# EAGLE design high-power-led-holder (EAGLE 7.5.0)
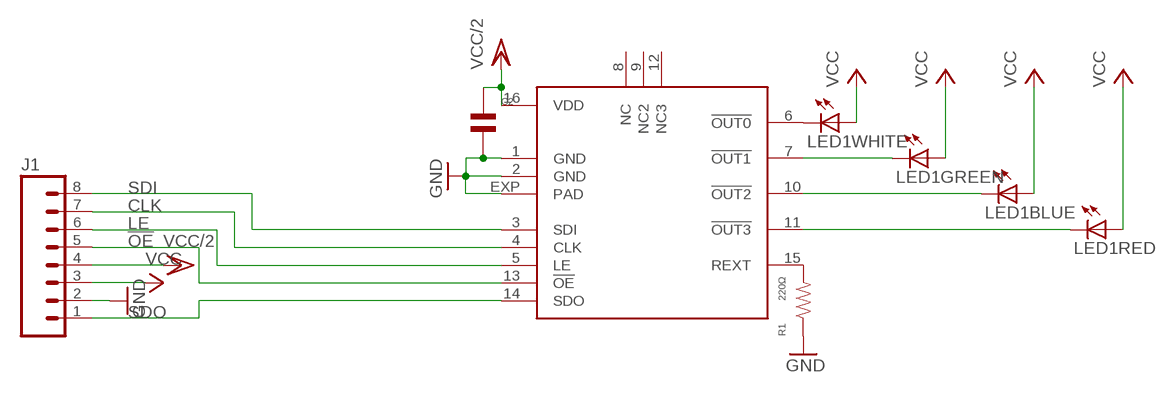
[diagram p0: schematic, sheet 1]

## Parts
C2  CAPACITOR_NP_0805  [C0805]
IC1  STP04CM05  [TSSOP16L]
J1  M08  [1X08_ROUND]
LED1  4WLEDBOARD  [4WLEDBOARD]
R1  220Ω  RESISTOR_0805  [R0805]

## Nets
!OE: IC1.13(!OE) J1.5
CLK: IC1.4(CLK) J1.7
GND: C2.P$2 IC1.1(GND) IC1.2(GND) IC1.EXP(PAD) J1.2 R1.P$1
LE: IC1.5(LE) J1.6
N$2: IC1.7(!OUT1) LED1.G-(GREEN:C)
N$3: IC1.6(!OUT0) LED1.W-(WHITE:C)
N$4: IC1.10(!OUT2) LED1.B-(BLUE:C)
N$5: IC1.11(!OUT3) LED1.R-(RED:C)
N$9: IC1.15(REXT) R1.P$2
SDI: IC1.3(SDI) J1.8
SDO: IC1.14(SDO) J1.1
VCC: J1.3 LED1.B+(BLUE:A) LED1.G+(GREEN:A) LED1.R+(RED:A) LED1.W+(WHITE:A)
VCC/2: C2.P$1 IC1.16(VDD) J1.4
Unconnected: IC1.8(NC) IC1.9(NC2) IC1.12(NC3)

## Library data of the parts
C2 = MF_Passives:CAPACITOR_NP: Library: MF_Passives Description: Device for Non-Polarized Capacitors. Manufacture part number (MFG#), Voltage, Temperature Coefficient, and Tolerance can be added via Attributes.; MFG#: N/A; TEMP_COF: N/A; TOLERANCE: N/A; VOLTAGE: N/A
IC1 = sonik:STP04CM05
J1 = SparkFun-Connectors:M08: Header 8 Standard 8-pin 0.1" header. Use with straight break away headers (SKU : PRT-00116), right angle break away headers (PRT-00553), swiss pins (PRT-00743), machine pins (PRT-00117), and female headers (PRT-00115).; PROD_ID: CONN-08437
LED1 = sonik:4WLEDBOARD
R1 = MF_Passives:RESISTOR: Library: MF_Passives Description: Device for Resistors. Manufacture part number (MFG#), Voltage, Tolerance, and Wattage Rating can be added via Attributes.; MFG#: N/A; TOLERANCE: N/A; VOLTAGE: N/A; WATTAGE: N/A

## Board
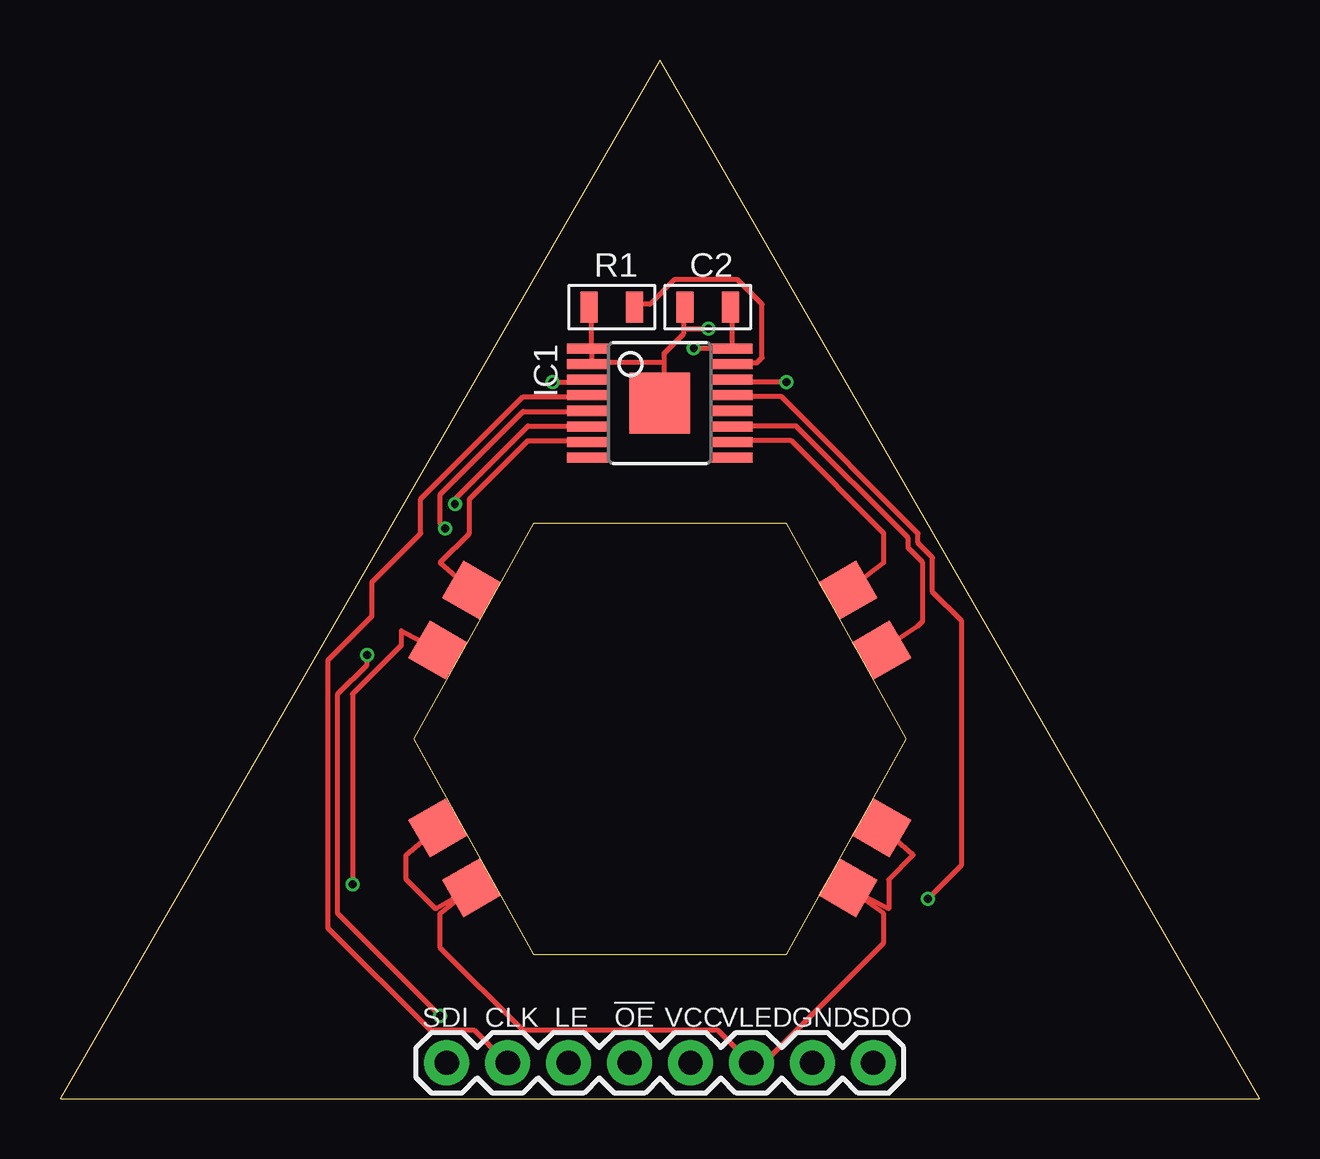
[diagram p1: board, top side]
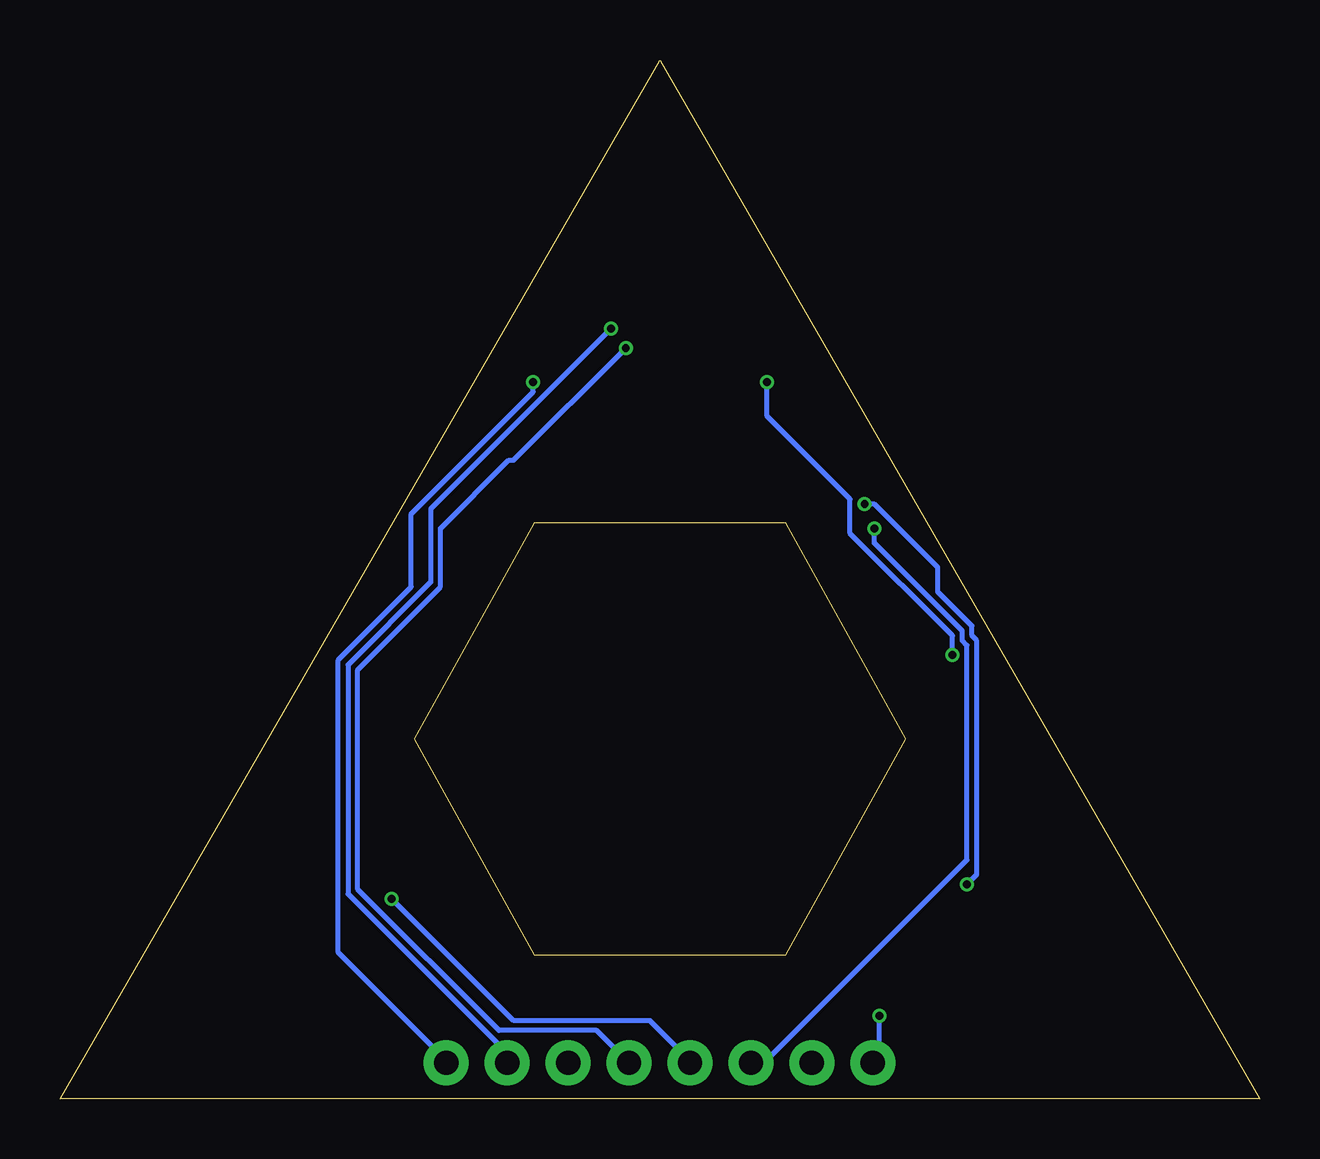
[diagram p2: board, bottom side, seen from below]

Size 50 x 43.3 mm. Coordinates in mm from the lower left corner, seen from the top.
Outline: 0,0 50,0 25,43.3 0,0
Copper layers (1*16): Top 0.0356mm / dielectric 1.5011mm / Bottom 0.0356mm
Design rules "OSHparkDruTented8mil": minimum track width 8mil, minimum drill 13mil, track to track 8mil, track to pad 8mil, pad to pad 8mil, via to via 8mil, smd to smd 5mil, copper to edge 15mil, drill to drill 6mil, minimum pad ring 5mil, minimum via ring 5mil, stop-mask expansion 3mil, vias tented up to drill 14mil, thermal gap 10mil

### Footprints (pad centres in the part's own frame; a part is rotated, then mirrored left to right if it is on the bottom)
C0805 = smd 0.7 x 1.3: P$1 -0.95,0; P$2 0.95,0
TSSOP16L = smd 0.42 x 1.78: 1 -2.275,-2.97; 2 -1.625,-2.97; 3 -0.975,-2.97; 4 -0.325,-2.97; 5 0.325,-2.97; 6 0.975,-2.97; 7 1.625,-2.97; 8 2.275,-2.97; 9 2.275,2.97; 10 1.625,2.97; 11 0.975,2.97; 12 0.325,2.97; 13 -0.325,2.97; 14 -0.975,2.97; 15 -1.625,2.97; 16 -2.275,2.97 | smd 2.54 x 2.54: EXP 0,0
1X08_ROUND = drill 1.016 pad 1.88: 1 0,0; 2 2.54,0; 3 5.08,0; 4 7.62,0; 5 10.16,0; 6 12.7,0; 7 15.24,0; 8 17.78,0
4WLEDBOARD = smd 1.8 x 1.8 rotated 60: B+ 7.85,-6.2; G- -7.85,6.2; R+ 9.25,-3.7; W- -9.25,3.7 | smd 1.8 x 1.8 rotated 120: B- 7.85,6.2; G+ -7.85,-6.2; R- 9.25,3.7; W+ -9.25,-3.7
R0805 = smd 0.7 x 1.3: P$1 -0.95,0; P$2 0.95,0

### Placement (x,y rotation side)
C2  27,33 180 top
IC1  25,29 270 top
J1  33.9,1.5 180 top
LED1  25,15 0 top
R1  23,33 0 top

### Tracks (layer width: path | path; a pad name or v marks a point on that pad's centre or on a via)
!OE  (via drill 0.33)
  Top 0.203: v36.17,8.33 37.59,9.75 37.59,19.91 36.37,21.13 36.37,22.55 35.76,23.16 35.76,23.57 30.07,29.26 28.04,29.26 IC1.13
  Bottom 0.203: v36.17,8.33 31.09,3.25 25.4,3.25 23.77,1.63 J1.5
CLK
  Top 0.203: IC1.4 21.95,29.26 19.3,29.26 15.04,24.99 15.04,23.57 13.01,21.54 13.01,20.12 11.18,18.29 11.18,7.11 15.44,2.85 17.27,2.85 18.49,1.63 J1.7
GND  (via drill 0.33)
  Top 0.203: R1.P$1 22.15,32.92 22.15,31.29 IC1.1 22.15,31.09 22.15,30.68 | 26.01,32.11 26.01,31.9 25.2,31.09 25.2,30.68 | 26.01,32.11 26.01,32.92 C2.P$2 | 25.2,30.68 25.2,29.06 IC1.EXP | 25.2,30.68 22.15,30.68 | 22.15,30.68 IC1.2 | 26.01,32.11 v27.03,32.11
  Bottom 0.203: v27.03,32.11 34.54,24.59 34.54,21.54 38,18.09 38,8.53 31.5,2.03 31.5,1.63 J1.2
LE  (via drill 0.33)
  Top 0.203: v16.05,23.77 15.85,23.98 15.85,25.2 19.3,28.65 21.95,28.65 IC1.5
  Bottom 0.203: v16.05,23.77 16.05,23.16 12.39,19.51 12.39,19.1 12.19,18.9 12.19,9.96 20.52,1.63 21.13,1.63 J1.6
N$2
  Top 0.203: IC1.7 21.95,27.43 19.51,27.43 17.07,24.99 17.07,23.57 15.85,22.35 LED1.G-
N$3  (via drill 0.33)
  Top 0.203: v16.46,24.79 16.46,24.99 19.51,28.04 21.95,28.04 IC1.6 | v12.19,8.94 12.19,16.87 14.22,18.9 14.22,19.51 LED1.W-
  Bottom 0.203: v16.46,24.79 16.05,24.79 13.41,22.15 13.41,21.13 11.99,19.71 11.99,19.3 11.79,19.1 11.79,9.35 v12.19,8.94
N$4
  Top 0.203: IC1.10 28.04,27.43 30.48,27.43 34.34,23.57 34.34,22.35 LED1.B-
N$5
  Top 0.203: IC1.11 28.04,28.04 30.68,28.04 35.36,23.37 35.36,22.96 35.97,22.35 35.97,19.91 35.76,19.71 LED1.R-
N$9
  Top 0.203: R1.P$2 23.98,33.12 24.59,33.12 25.6,34.14 28.25,34.14 29.26,33.12 29.26,30.89 29.06,30.68 28.04,30.68 IC1.15
SDI  (via drill 0.33)
  Top 0.203: v20.52,29.87 21.95,29.87 IC1.3 | v12.8,18.49 12.8,18.09 11.58,16.87 11.58,7.72 v15.85,3.45
  Bottom 0.203: v20.52,29.87 20.52,28.45 17.07,24.99 17.07,23.57 12.8,19.3 v12.8,18.49 | v15.85,3.45 15.85,1.83 16.05,1.63 J1.8
SDO  (via drill 0.33)
  Top 0.203: v30.28,29.87 28.04,29.87 IC1.14
  Bottom 0.203: v30.28,29.87 30.28,29.46 35.36,24.38 35.36,21.34 38.41,18.29 38.41,6.1 33.93,1.63 J1.1
VCC
  Top 0.203: LED1.R+ 35.56,10.16 34.54,9.14 34.54,7.92 LED1.B+ 34.34,7.72 34.34,6.5 29.46,1.63 28.85,1.63 J1.3 28.65,1.63 27.43,2.85 19.3,2.85 15.85,6.3 15.85,7.72 LED1.G+ 15.65,7.92 14.43,9.14 14.43,10.16 LED1.W+
VCC/2  (via drill 0.33)
  Top 0.203: C2.P$1 28.04,32.92 28.04,31.29 IC1.16 27.84,31.29 v26.42,31.29
  Bottom 0.203: v26.42,31.29 31.09,26.62 31.29,26.62 34.14,23.77 34.14,21.34 37.59,17.88 37.59,8.74 31.7,2.85 27.64,2.85 26.42,1.63 J1.4

### Text on the board
tNames: SDI | CLK | LE | !OE | VCC | VLED | GND | SDO